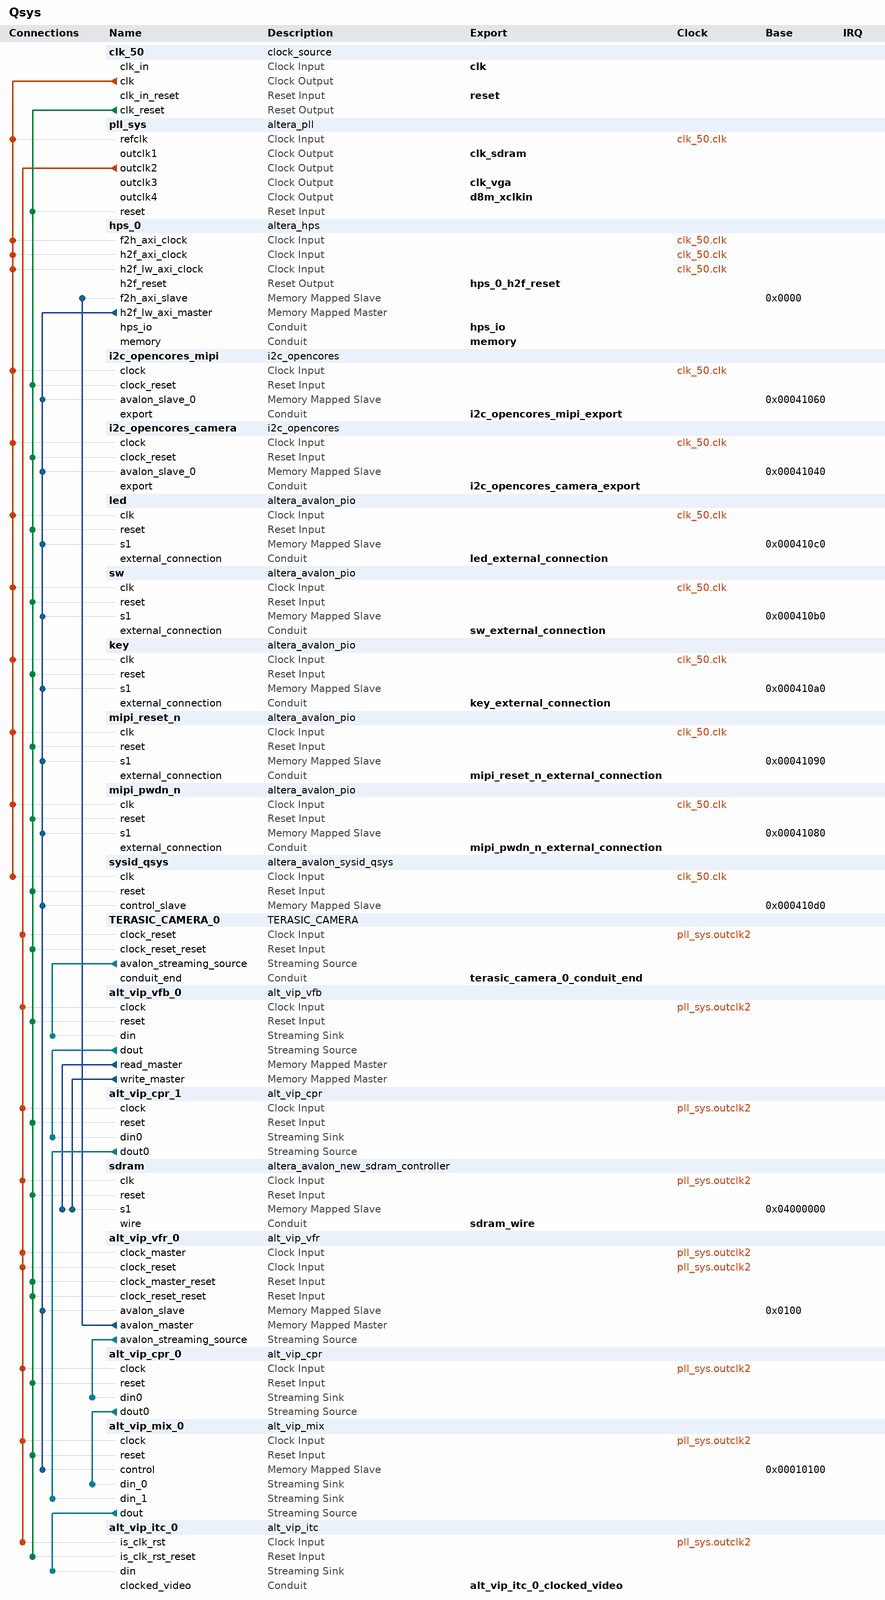
[diagram p0: system contents]
# Platform Designer (Qsys) system Qsys, Cyclone V 5CSEMA5F31C6
# Parameters at their usual value, and those the tool derives, are not listed.
package require -exact qsys 15.0
create_system Qsys
set_project_property DEVICE_FAMILY {Cyclone V}
set_project_property DEVICE 5CSEMA5F31C6

add_instance clk_50 clock_source 15.0
set_instance_parameter_value clk_50 clockFrequency 50000000

add_instance pll_sys altera_pll 15.0
set_instance_parameter_value pll_sys gui_device_speed_grade 2
set_instance_parameter_value pll_sys gui_number_of_clocks 5
set_instance_parameter_value pll_sys gui_operation_mode normal
set_instance_parameter_value pll_sys gui_output_clock_frequency0 130.0
set_instance_parameter_value pll_sys gui_output_clock_frequency1 130.0
set_instance_parameter_value pll_sys gui_output_clock_frequency2 130.0
set_instance_parameter_value pll_sys gui_output_clock_frequency3 65.0
set_instance_parameter_value pll_sys gui_phase_shift1 -3000
set_instance_parameter_value pll_sys gui_phase_shift_deg1 -90.0
set_instance_parameter_value pll_sys gui_pll_mode {Integer-N PLL}
set_instance_parameter_value pll_sys gui_reference_clock_frequency 50.0
set_instance_parameter_value pll_sys gui_use_locked false

add_instance hps_0 altera_hps 15.0
set_instance_parameter_value hps_0 EMAC1_Mode RGMII
set_instance_parameter_value hps_0 EMAC1_PinMuxing {HPS I/O Set 0}
set_instance_parameter_value hps_0 F2SCLK_COLDRST_Enable false
set_instance_parameter_value hps_0 F2SCLK_DBGRST_Enable false
set_instance_parameter_value hps_0 F2SCLK_WARMRST_Enable false
set_instance_parameter_value hps_0 F2SINTERRUPT_Enable true
set_instance_parameter_value hps_0 F2S_Width 3
set_instance_parameter_value hps_0 FPGA_PERIPHERAL_OUTPUT_CLOCK_FREQ_EMAC0_GTX_CLK 100
set_instance_parameter_value hps_0 FPGA_PERIPHERAL_OUTPUT_CLOCK_FREQ_EMAC0_MD_CLK 2.5
set_instance_parameter_value hps_0 FPGA_PERIPHERAL_OUTPUT_CLOCK_FREQ_EMAC1_GTX_CLK 100
set_instance_parameter_value hps_0 FPGA_PERIPHERAL_OUTPUT_CLOCK_FREQ_EMAC1_MD_CLK 2.5
set_instance_parameter_value hps_0 HPS_PROTOCOL DDR3
set_instance_parameter_value hps_0 I2C0_Mode I2C
set_instance_parameter_value hps_0 I2C0_PinMuxing {HPS I/O Set 0}
set_instance_parameter_value hps_0 I2C1_Mode I2C
set_instance_parameter_value hps_0 I2C1_PinMuxing {HPS I/O Set 0}
set_instance_parameter_value hps_0 LWH2F_Enable true
set_instance_parameter_value hps_0 MEM_BANKADDR_WIDTH 3
set_instance_parameter_value hps_0 MEM_CLK_FREQ 400.0
set_instance_parameter_value hps_0 MEM_COL_ADDR_WIDTH 10
set_instance_parameter_value hps_0 MEM_DQ_WIDTH 32
set_instance_parameter_value hps_0 MEM_DRV_STR RZQ/7
set_instance_parameter_value hps_0 MEM_ROW_ADDR_WIDTH 15
set_instance_parameter_value hps_0 MEM_RTT_NOM RZQ/4
set_instance_parameter_value hps_0 MEM_RTT_WR RZQ/4
set_instance_parameter_value hps_0 MEM_TCL 11
set_instance_parameter_value hps_0 MEM_TFAW_NS 30.0
set_instance_parameter_value hps_0 MEM_TRAS_NS 35.0
set_instance_parameter_value hps_0 MEM_TRCD_NS 13.75
set_instance_parameter_value hps_0 MEM_TRFC_NS 260.0
set_instance_parameter_value hps_0 MEM_TRP_NS 13.75
set_instance_parameter_value hps_0 MEM_VENDOR JEDEC
set_instance_parameter_value hps_0 MEM_WTCL 8
set_instance_parameter_value hps_0 QSPI_Mode {1 SS}
set_instance_parameter_value hps_0 QSPI_PinMuxing {HPS I/O Set 0}
set_instance_parameter_value hps_0 REF_CLK_FREQ 25.0
set_instance_parameter_value hps_0 S2F_Width 2
set_instance_parameter_value hps_0 SDIO_Mode {4-bit Data}
set_instance_parameter_value hps_0 SDIO_PinMuxing {HPS I/O Set 0}
set_instance_parameter_value hps_0 SPIM1_Mode {Single Slave Select}
set_instance_parameter_value hps_0 SPIM1_PinMuxing {HPS I/O Set 0}
set_instance_parameter_value hps_0 STM_Enable false
set_instance_parameter_value hps_0 TIMING_BOARD_AC_SKEW 0.03
set_instance_parameter_value hps_0 TIMING_BOARD_AC_TO_CK_SKEW 0.0
set_instance_parameter_value hps_0 TIMING_BOARD_DQ_TO_DQS_SKEW 0.0
set_instance_parameter_value hps_0 TIMING_BOARD_MAX_CK_DELAY 0.03
set_instance_parameter_value hps_0 TIMING_BOARD_MAX_DQS_DELAY 0.02
set_instance_parameter_value hps_0 TIMING_BOARD_SKEW_BETWEEN_DQS 0.08
set_instance_parameter_value hps_0 TIMING_BOARD_SKEW_CKDQS_DIMM_MAX 0.16
set_instance_parameter_value hps_0 TIMING_BOARD_SKEW_CKDQS_DIMM_MIN 0.09
set_instance_parameter_value hps_0 TIMING_BOARD_SKEW_WITHIN_DQS 0.01
set_instance_parameter_value hps_0 TIMING_TDH 65
set_instance_parameter_value hps_0 TIMING_TDQSCK 255
set_instance_parameter_value hps_0 TIMING_TDQSQ 125
set_instance_parameter_value hps_0 TIMING_TDS 30
set_instance_parameter_value hps_0 TIMING_TIH 140
set_instance_parameter_value hps_0 TIMING_TIS 180
set_instance_parameter_value hps_0 TIMING_TQSH 0.4
set_instance_parameter_value hps_0 UART0_Mode {No Flow Control}
set_instance_parameter_value hps_0 UART0_PinMuxing {HPS I/O Set 0}
set_instance_parameter_value hps_0 USB1_Mode SDR
set_instance_parameter_value hps_0 USB1_PinMuxing {HPS I/O Set 0}
set_instance_parameter_value hps_0 desired_cfg_clk_mhz 100.0
set_instance_parameter_value hps_0 desired_qspi_clk_mhz 400.0

add_instance i2c_opencores_mipi i2c_opencores 12.0

add_instance i2c_opencores_camera i2c_opencores 12.0

add_instance led altera_avalon_pio 15.0
set_instance_parameter_value led direction Output
set_instance_parameter_value led width 10

add_instance sw altera_avalon_pio 15.0
set_instance_parameter_value sw direction Input
set_instance_parameter_value sw width 10

add_instance key altera_avalon_pio 15.0
set_instance_parameter_value key direction Input
set_instance_parameter_value key width 4

add_instance mipi_reset_n altera_avalon_pio 15.0
set_instance_parameter_value mipi_reset_n direction Output
set_instance_parameter_value mipi_reset_n width 1

add_instance mipi_pwdn_n altera_avalon_pio 15.0
set_instance_parameter_value mipi_pwdn_n direction Output
set_instance_parameter_value mipi_pwdn_n width 1

add_instance sysid_qsys altera_avalon_sysid_qsys 15.0
set_instance_parameter_value sysid_qsys id 0

add_instance TERASIC_CAMERA_0 TERASIC_CAMERA 1.0

add_instance alt_vip_vfb_0 alt_vip_vfb 13.1

add_instance alt_vip_cpr_1 alt_vip_cpr 13.1
set_instance_parameter_value alt_vip_cpr_1 DIN0_SYMBOLS_PER_BEAT 3
set_instance_parameter_value alt_vip_cpr_1 DIN1_ENABLED 0
set_instance_parameter_value alt_vip_cpr_1 DIN1_SYMBOLS_PER_BEAT 0
set_instance_parameter_value alt_vip_cpr_1 DOUT0_SYMBOLS_PER_BEAT 3
set_instance_parameter_value alt_vip_cpr_1 DOUT1_ENABLED 0
set_instance_parameter_value alt_vip_cpr_1 DOUT1_SYMBOLS_PER_BEAT 0
set_instance_parameter_value alt_vip_cpr_1 PARAMETERISATION {<colourPatternRearrangerParams><CPR_NAME>Color Plane Sequencer</CPR_NAME><CPR_BPS>8</CPR_BPS><CPR_PORTS><INPUT_PORT><NAME>din0</NAME><STREAMING_DESCRIPTOR>[R:G:B]</STREAMING_DESCRIPTOR><ENABLED>true</ENABLED></INPUT_PORT><INPUT_PORT><NAME>din1</NAME><STREAMING_DESCRIPTOR>[Channel]</STREAMING_DESCRIPTOR><ENABLED>false</ENABLED></INPUT_PORT><OUTPUT_PORT><NAME>dout0</NAME><STREAMING_DESCRIPTOR>[B:G:R]</STREAMING_DESCRIPTOR><ENABLED>true</ENABLED><NON_IMAGE_PACKET_SOURCE>din0</NON_IMAGE_PACKET_SOURCE><HALVE_WIDTH>false</HALVE_WIDTH></OUTPUT_PORT><OUTPUT_PORT><NAME>dout1</NAME><STREAMING_DESCRIPTOR>[Channel]</STREAMING_DESCRIPTOR><ENABLED>false</ENABLED><NON_IMAGE_PACKET_SOURCE>din0</NON_IMAGE_PACKET_SOURCE><HALVE_WIDTH>false</HALVE_WIDTH></OUTPUT_PORT></CPR_PORTS><CPR_INPUT_2_PIXELS>false</CPR_INPUT_2_PIXELS></colourPatternRearrangerParams>}

add_instance sdram altera_avalon_new_sdram_controller 15.0
set_instance_parameter_value sdram TAC 5.5
set_instance_parameter_value sdram TRCD 20.0
set_instance_parameter_value sdram TRP 20.0
set_instance_parameter_value sdram casLatency 3
set_instance_parameter_value sdram columnWidth 10
set_instance_parameter_value sdram dataWidth 16
set_instance_parameter_value sdram generateSimulationModel true
set_instance_parameter_value sdram model single_Micron_MT48LC4M32B2_7_chip
set_instance_parameter_value sdram numberOfBanks 4
set_instance_parameter_value sdram numberOfChipSelects 1
set_instance_parameter_value sdram powerUpDelay 100.0
set_instance_parameter_value sdram refreshPeriod 15.625
set_instance_parameter_value sdram rowWidth 13

add_instance alt_vip_vfr_0 alt_vip_vfr 14.0
set_instance_parameter_value alt_vip_vfr_0 MAX_IMAGE_WIDTH 1024

add_instance alt_vip_cpr_0 alt_vip_cpr 13.1
set_instance_parameter_value alt_vip_cpr_0 DIN0_SYMBOLS_PER_BEAT 4
set_instance_parameter_value alt_vip_cpr_0 DIN1_ENABLED 0
set_instance_parameter_value alt_vip_cpr_0 DIN1_SYMBOLS_PER_BEAT 0
set_instance_parameter_value alt_vip_cpr_0 DOUT0_SYMBOLS_PER_BEAT 3
set_instance_parameter_value alt_vip_cpr_0 DOUT1_ENABLED 0
set_instance_parameter_value alt_vip_cpr_0 DOUT1_SYMBOLS_PER_BEAT 0
set_instance_parameter_value alt_vip_cpr_0 PARAMETERISATION {<colourPatternRearrangerParams><CPR_NAME>Color Plane Sequencer</CPR_NAME><CPR_BPS>8</CPR_BPS><CPR_PORTS><INPUT_PORT><NAME>din0</NAME><STREAMING_DESCRIPTOR>[B:G:R:unnamed]</STREAMING_DESCRIPTOR><ENABLED>true</ENABLED></INPUT_PORT><INPUT_PORT><NAME>din1</NAME><STREAMING_DESCRIPTOR>[Channel]</STREAMING_DESCRIPTOR><ENABLED>false</ENABLED></INPUT_PORT><OUTPUT_PORT><NAME>dout0</NAME><STREAMING_DESCRIPTOR>[B:G:R]</STREAMING_DESCRIPTOR><ENABLED>true</ENABLED><NON_IMAGE_PACKET_SOURCE>din0</NON_IMAGE_PACKET_SOURCE><HALVE_WIDTH>false</HALVE_WIDTH></OUTPUT_PORT><OUTPUT_PORT><NAME>dout1</NAME><STREAMING_DESCRIPTOR>[Channel]</STREAMING_DESCRIPTOR><ENABLED>false</ENABLED><NON_IMAGE_PACKET_SOURCE>din0</NON_IMAGE_PACKET_SOURCE><HALVE_WIDTH>false</HALVE_WIDTH></OUTPUT_PORT></CPR_PORTS><CPR_INPUT_2_PIXELS>false</CPR_INPUT_2_PIXELS></colourPatternRearrangerParams>}

add_instance alt_vip_mix_0 alt_vip_mix 13.1
set_instance_parameter_value alt_vip_mix_0 PARAMETERISATION {<mixerParams><MIX_NAME>mixer</MIX_NAME><MIX_ALPHA_ENABLED>false</MIX_ALPHA_ENABLED><MIX_ALPHA_BPS>8</MIX_ALPHA_BPS><MIX_CHANNELS_IN_SEQ>1</MIX_CHANNELS_IN_SEQ><MIX_CHANNELS_IN_PAR>3</MIX_CHANNELS_IN_PAR><MIX_BPS>8</MIX_BPS><MIX_NUM_LAYERS>2</MIX_NUM_LAYERS><MIX_RUNTIME_MAX_WIDTH>1024</MIX_RUNTIME_MAX_WIDTH><MIX_RUNTIME_MAX_HEIGHT>768</MIX_RUNTIME_MAX_HEIGHT></mixerParams>}

add_instance alt_vip_itc_0 alt_vip_itc 14.0
set_instance_parameter_value alt_vip_itc_0 FIFO_DEPTH 1024
set_instance_parameter_value alt_vip_itc_0 H_ACTIVE_PIXELS 1024
set_instance_parameter_value alt_vip_itc_0 H_BACK_PORCH 160
set_instance_parameter_value alt_vip_itc_0 H_FRONT_PORCH 24
set_instance_parameter_value alt_vip_itc_0 H_SYNC_LENGTH 136
set_instance_parameter_value alt_vip_itc_0 NUMBER_OF_COLOUR_PLANES 3
set_instance_parameter_value alt_vip_itc_0 THRESHOLD 1023
set_instance_parameter_value alt_vip_itc_0 V_ACTIVE_LINES 768
set_instance_parameter_value alt_vip_itc_0 V_BACK_PORCH 29
set_instance_parameter_value alt_vip_itc_0 V_FRONT_PORCH 3
set_instance_parameter_value alt_vip_itc_0 V_SYNC_LENGTH 6

# connections
add_connection clk_50.clk hps_0.f2h_axi_clock clock
add_connection clk_50.clk hps_0.h2f_axi_clock clock
add_connection clk_50.clk hps_0.h2f_lw_axi_clock clock
add_connection clk_50.clk i2c_opencores_camera.clock clock
add_connection clk_50.clk i2c_opencores_mipi.clock clock
add_connection clk_50.clk key.clk clock
add_connection clk_50.clk led.clk clock
add_connection clk_50.clk mipi_pwdn_n.clk clock
add_connection clk_50.clk mipi_reset_n.clk clock
add_connection clk_50.clk pll_sys.refclk clock
add_connection clk_50.clk sw.clk clock
add_connection clk_50.clk sysid_qsys.clk clock
add_connection pll_sys.outclk2 alt_vip_cpr_0.clock clock
add_connection pll_sys.outclk2 alt_vip_cpr_1.clock clock
add_connection pll_sys.outclk2 alt_vip_itc_0.is_clk_rst clock
add_connection pll_sys.outclk2 alt_vip_mix_0.clock clock
add_connection pll_sys.outclk2 alt_vip_vfb_0.clock clock
add_connection pll_sys.outclk2 alt_vip_vfr_0.clock_master clock
add_connection pll_sys.outclk2 alt_vip_vfr_0.clock_reset clock
add_connection pll_sys.outclk2 sdram.clk clock
add_connection pll_sys.outclk2 TERASIC_CAMERA_0.clock_reset clock
add_connection clk_50.clk_reset alt_vip_cpr_0.reset reset
add_connection clk_50.clk_reset alt_vip_cpr_1.reset reset
add_connection clk_50.clk_reset alt_vip_itc_0.is_clk_rst_reset reset
add_connection clk_50.clk_reset alt_vip_mix_0.reset reset
add_connection clk_50.clk_reset alt_vip_vfb_0.reset reset
add_connection clk_50.clk_reset alt_vip_vfr_0.clock_master_reset reset
add_connection clk_50.clk_reset alt_vip_vfr_0.clock_reset_reset reset
add_connection clk_50.clk_reset i2c_opencores_camera.clock_reset reset
add_connection clk_50.clk_reset i2c_opencores_mipi.clock_reset reset
add_connection clk_50.clk_reset key.reset reset
add_connection clk_50.clk_reset led.reset reset
add_connection clk_50.clk_reset mipi_pwdn_n.reset reset
add_connection clk_50.clk_reset mipi_reset_n.reset reset
add_connection clk_50.clk_reset pll_sys.reset reset
add_connection clk_50.clk_reset sdram.reset reset
add_connection clk_50.clk_reset sw.reset reset
add_connection clk_50.clk_reset sysid_qsys.reset reset
add_connection clk_50.clk_reset TERASIC_CAMERA_0.clock_reset_reset reset
add_connection alt_vip_vfb_0.read_master sdram.s1 avalon
set_connection_parameter_value alt_vip_vfb_0.read_master/sdram.s1 arbitrationPriority 50
set_connection_parameter_value alt_vip_vfb_0.read_master/sdram.s1 baseAddress 0x04000000
add_connection alt_vip_vfb_0.write_master sdram.s1 avalon
set_connection_parameter_value alt_vip_vfb_0.write_master/sdram.s1 arbitrationPriority 30
set_connection_parameter_value alt_vip_vfb_0.write_master/sdram.s1 baseAddress 0x04000000
add_connection alt_vip_vfr_0.avalon_master hps_0.f2h_axi_slave avalon
set_connection_parameter_value alt_vip_vfr_0.avalon_master/hps_0.f2h_axi_slave baseAddress 0x0000
add_connection hps_0.h2f_lw_axi_master alt_vip_mix_0.control avalon
set_connection_parameter_value hps_0.h2f_lw_axi_master/alt_vip_mix_0.control baseAddress 0x00010100
add_connection hps_0.h2f_lw_axi_master alt_vip_vfr_0.avalon_slave avalon
set_connection_parameter_value hps_0.h2f_lw_axi_master/alt_vip_vfr_0.avalon_slave baseAddress 0x0100
add_connection hps_0.h2f_lw_axi_master i2c_opencores_camera.avalon_slave_0 avalon
set_connection_parameter_value hps_0.h2f_lw_axi_master/i2c_opencores_camera.avalon_slave_0 baseAddress 0x00041040
add_connection hps_0.h2f_lw_axi_master i2c_opencores_mipi.avalon_slave_0 avalon
set_connection_parameter_value hps_0.h2f_lw_axi_master/i2c_opencores_mipi.avalon_slave_0 baseAddress 0x00041060
add_connection hps_0.h2f_lw_axi_master key.s1 avalon
set_connection_parameter_value hps_0.h2f_lw_axi_master/key.s1 baseAddress 0x000410a0
add_connection hps_0.h2f_lw_axi_master led.s1 avalon
set_connection_parameter_value hps_0.h2f_lw_axi_master/led.s1 baseAddress 0x000410c0
add_connection hps_0.h2f_lw_axi_master mipi_pwdn_n.s1 avalon
set_connection_parameter_value hps_0.h2f_lw_axi_master/mipi_pwdn_n.s1 baseAddress 0x00041080
add_connection hps_0.h2f_lw_axi_master mipi_reset_n.s1 avalon
set_connection_parameter_value hps_0.h2f_lw_axi_master/mipi_reset_n.s1 baseAddress 0x00041090
add_connection hps_0.h2f_lw_axi_master sw.s1 avalon
set_connection_parameter_value hps_0.h2f_lw_axi_master/sw.s1 baseAddress 0x000410b0
add_connection hps_0.h2f_lw_axi_master sysid_qsys.control_slave avalon
set_connection_parameter_value hps_0.h2f_lw_axi_master/sysid_qsys.control_slave baseAddress 0x000410d0
add_connection alt_vip_cpr_0.dout0 alt_vip_mix_0.din_0 avalon_streaming
add_connection alt_vip_cpr_1.dout0 alt_vip_mix_0.din_1 avalon_streaming
add_connection alt_vip_mix_0.dout alt_vip_itc_0.din avalon_streaming
add_connection alt_vip_vfb_0.dout alt_vip_cpr_1.din0 avalon_streaming
add_connection alt_vip_vfr_0.avalon_streaming_source alt_vip_cpr_0.din0 avalon_streaming
add_connection TERASIC_CAMERA_0.avalon_streaming_source alt_vip_vfb_0.din avalon_streaming

# exported interfaces
add_interface alt_vip_itc_0_clocked_video conduit end
set_interface_property alt_vip_itc_0_clocked_video EXPORT_OF alt_vip_itc_0.clocked_video
add_interface clk clock sink
set_interface_property clk EXPORT_OF clk_50.clk_in
add_interface clk_sdram clock source
set_interface_property clk_sdram EXPORT_OF pll_sys.outclk1
add_interface clk_vga clock source
set_interface_property clk_vga EXPORT_OF pll_sys.outclk3
add_interface d8m_xclkin clock source
set_interface_property d8m_xclkin EXPORT_OF pll_sys.outclk4
add_interface hps_0_h2f_reset reset source
set_interface_property hps_0_h2f_reset EXPORT_OF hps_0.h2f_reset
add_interface hps_io conduit end
set_interface_property hps_io EXPORT_OF hps_0.hps_io
add_interface i2c_opencores_camera_export conduit end
set_interface_property i2c_opencores_camera_export EXPORT_OF i2c_opencores_camera.export
add_interface i2c_opencores_mipi_export conduit end
set_interface_property i2c_opencores_mipi_export EXPORT_OF i2c_opencores_mipi.export
add_interface key_external_connection conduit end
set_interface_property key_external_connection EXPORT_OF key.external_connection
add_interface led_external_connection conduit end
set_interface_property led_external_connection EXPORT_OF led.external_connection
add_interface memory conduit end
set_interface_property memory EXPORT_OF hps_0.memory
add_interface mipi_pwdn_n_external_connection conduit end
set_interface_property mipi_pwdn_n_external_connection EXPORT_OF mipi_pwdn_n.external_connection
add_interface mipi_reset_n_external_connection conduit end
set_interface_property mipi_reset_n_external_connection EXPORT_OF mipi_reset_n.external_connection
add_interface reset reset sink
set_interface_property reset EXPORT_OF clk_50.clk_in_reset
add_interface sdram_wire conduit end
set_interface_property sdram_wire EXPORT_OF sdram.wire
add_interface sw_external_connection conduit end
set_interface_property sw_external_connection EXPORT_OF sw.external_connection
add_interface terasic_camera_0_conduit_end conduit end
set_interface_property terasic_camera_0_conduit_end EXPORT_OF TERASIC_CAMERA_0.conduit_end

set_interconnect_requirement {$system} qsys_mm.clockCrossingAdapter HANDSHAKE
set_interconnect_requirement {$system} qsys_mm.enableEccProtection FALSE
set_interconnect_requirement {$system} qsys_mm.insertDefaultSlave FALSE
set_interconnect_requirement {$system} qsys_mm.maxAdditionalLatency 1

save_system Qsys.qsys
